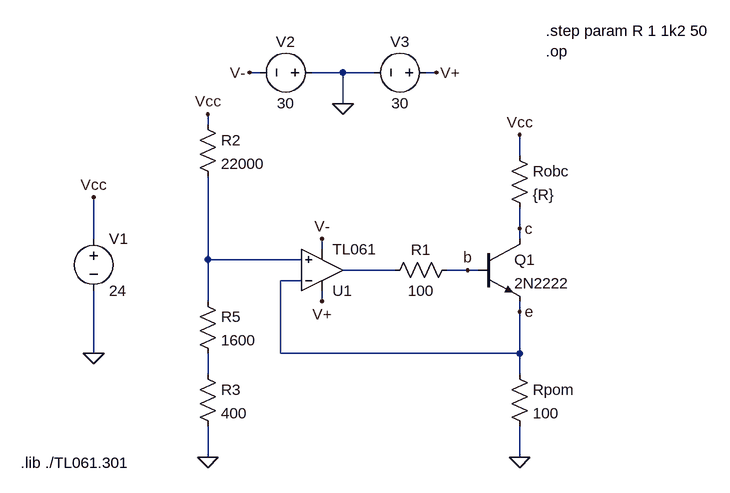
[diagram p0: schematic NPN_100.asc]
NPN_100.asc, the LTspice schematic file:
Version 4
SHEET 1 1228 680
WIRE 384 -272 368 -272
WIRE 512 -272 464 -272
WIRE 560 -272 512 -272
WIRE 656 -272 640 -272
WIRE 512 -224 512 -272
WIRE 304 -192 304 -208
WIRE 784 -144 784 -176
WIRE 784 -32 784 -64
WIRE 128 -16 128 -80
WIRE 784 -16 784 -32
WIRE 480 0 480 -16
WIRE 304 16 304 -112
WIRE 448 16 304 16
WIRE 592 32 512 32
WIRE 704 32 672 32
WIRE 720 32 704 32
WIRE 448 48 416 48
WIRE 304 80 304 16
WIRE 480 80 480 64
WIRE 784 96 784 80
WIRE 128 160 128 64
WIRE 416 160 416 48
WIRE 784 160 784 96
WIRE 784 160 416 160
WIRE 304 192 304 160
WIRE 784 192 784 160
WIRE 304 320 304 272
WIRE 784 320 784 272
FLAG 128 -80 Vcc
FLAG 128 160 0
FLAG 512 -224 0
FLAG 656 -272 V+
FLAG 368 -272 V-
FLAG 480 -16 V-
FLAG 480 80 V+
FLAG 784 -176 Vcc
FLAG 784 320 0
FLAG 784 96 e
FLAG 784 -32 c
FLAG 704 32 b
FLAG 304 320 0
FLAG 304 -208 Vcc
SYMBOL npn 720 -16 R0
SYMATTR InstName Q1
SYMATTR Value 2N2222
SYMBOL OpAmps\\opamp2 480 96 M180
SYMATTR InstName U1
SYMATTR Value TL061
SYMBOL voltage 128 -32 R0
WINDOW 123 0 0 Left 0
WINDOW 39 0 0 Left 0
SYMATTR InstName V1
SYMATTR Value 24
SYMBOL voltage 480 -272 R90
WINDOW 0 -32 56 VBottom 2
WINDOW 3 32 56 VTop 2
WINDOW 123 0 0 Left 0
WINDOW 39 0 0 Left 0
SYMATTR InstName V2
SYMATTR Value 30
SYMBOL voltage 656 -272 R90
WINDOW 0 -32 56 VBottom 2
WINDOW 3 32 56 VTop 2
WINDOW 123 0 0 Left 0
WINDOW 39 0 0 Left 0
SYMATTR InstName V3
SYMATTR Value 30
SYMBOL res 768 -160 R0
SYMATTR InstName Robc
SYMATTR Value {R}
SYMBOL res 768 176 R0
SYMATTR InstName Rpom
SYMATTR Value 100
SYMBOL res 688 16 R90
WINDOW 0 0 56 VBottom 2
WINDOW 3 32 56 VTop 2
SYMATTR InstName R1
SYMATTR Value 100
SYMBOL res 288 -208 R0
SYMATTR InstName R2
SYMATTR Value 22000
SYMBOL res 288 176 R0
SYMATTR InstName R3
SYMATTR Value 400
SYMBOL res 288 64 R0
SYMATTR InstName R5
SYMATTR Value 1600
TEXT 16 328 Left 2 !.lib ./TL061.301
TEXT 824 -336 Left 2 !.step param R 1 1k2 50\n.op

The netlist it stands for:
* NPN_100.asc
Q1 c b e 0 2N2222
XU1 N001 e V+ V- N002 TL061  ; pins In+ In- V+ V- OUT
V1 Vcc 0 24
V2 0 V- 30
V3 V+ 0 30
Robc Vcc c {R}
Rpom e 0 100
R1 b N002 100
R2 Vcc N001 22000
R3 N003 0 400
R5 N001 N003 1600
.model NPN NPN
.model PNP PNP
.lib standard.bjt
.lib ./TL061.301
.step param R 1 1k2 50
.op
.backanno
.end

* Results of the author's LTspice run, read from the files saved beside the schematic
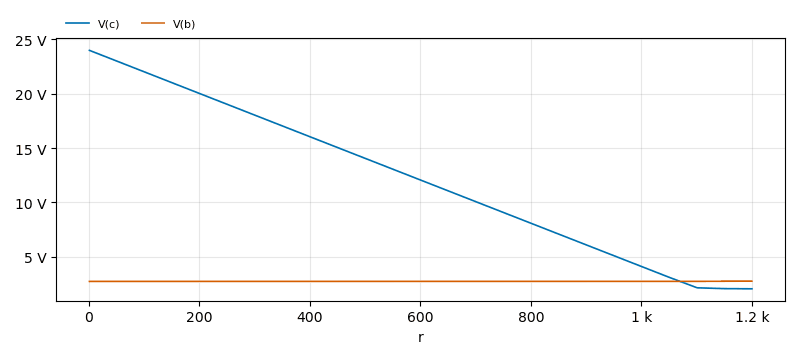
[diagram p1: Operating Point of NPN_100.asc, plotted from the saved traces]
* Operating Point, 1 run:
*   V(c): 23.98 V at r=1 , 2.053 V at r=1.2 k, min 2.053 V, max 23.98 V
*   V(b): 2.733 V at r=1 , 2.76 V at r=1.2 k, min 2.733 V, max 2.76 V
* From the log:
*   Semiconductor Device Operating Points:
*                           --- Diodes ---
*   Name:    d:u1:p      d:u1:ln     d:u1:lp     d:u1:e      d:u1:c
*   Model:    u1:dx       u1:dx       u1:dx       u1:dx       u1:dx
*   Id:     -6.00e-11   -1.51e-11   -1.49e-11   -3.05e-11   -2.51e-11
*   Vd:     -6.00e+01   -1.51e+01   -1.49e+01   -3.05e+01   -2.51e+01
*   Req:     1.00e+12    1.00e+12    1.00e+12    1.00e+12    1.00e+12
*   CAP:     0.00e+00    0.00e+00    0.00e+00    0.00e+00    0.00e+00
*                           --- Bipolar Transistors ---
*   Name:       q1
*   Model:    2n2222
*   Ib:       8.66e-05
*   Ic:       1.99e-02
*   Vbe:      7.34e-01
*   Vbc:     -2.12e+01
*   Vce:      2.20e+01
*   BetaDC:   2.30e+02
*   Gm:       7.32e-01
*   Rpi:      2.99e+02
*   Rx:       1.00e+01
*   Ro:       6.09e+03
*   Cbe:      3.34e-10
*   Cbc:      2.62e-12
*   Cjs:      0.00e+00
*   BetaAC:   2.19e+02
*   Cbx:      0.00e+00
*   Ft:       3.46e+08
*                           --- JFET Transistors ---
*   Name:    j:u1:2      j:u1:1
*   Model:    u1:jx       u1:jx
*   Id:     -2.60e-05   -2.61e-05
*   Vgs:     4.91e-01    4.91e-01
*   Vds:    -3.12e+01   -3.12e+01
*   Gm:      1.02e-04    1.02e-04
*   Gds:     0.00e+00    0.00e+00
*   Cgs:     0.00e+00    0.00e+00
*   Cgd:     0.00e+00    0.00e+00